# Altium schematic sheet 水温控制系统原理图.SchDoc
size A4
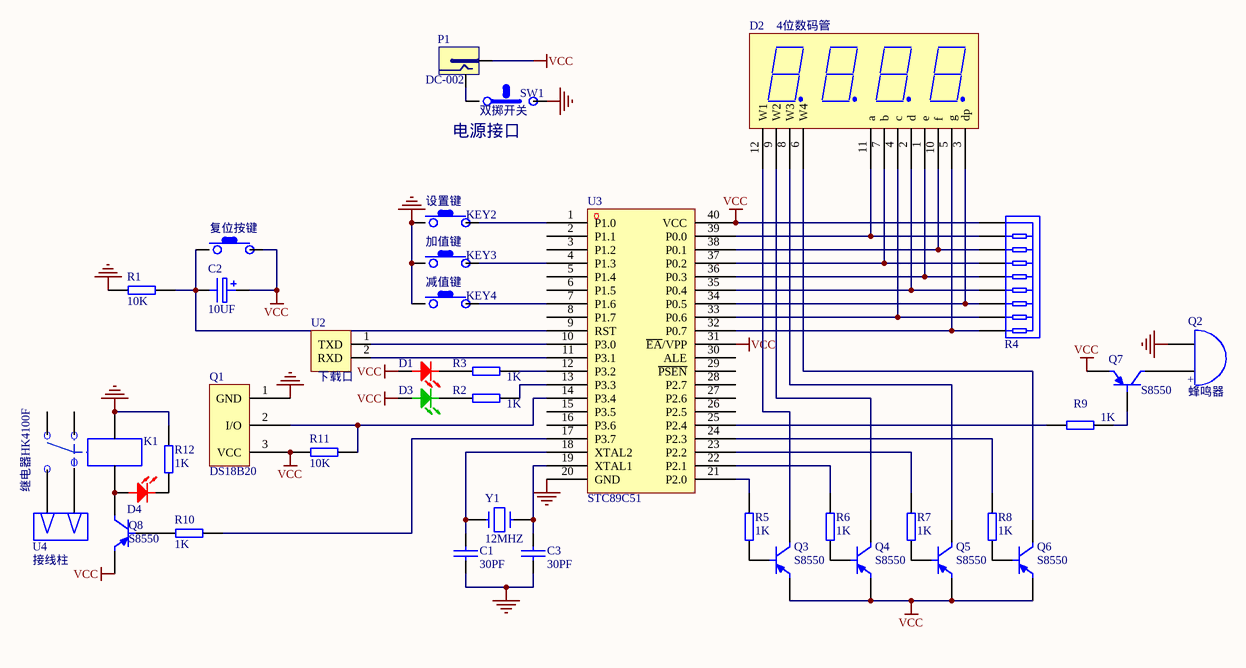
[diagram p0: 水温控制系统原理图.SchDoc]

## Parts
C1  30PF  [R38]
C2  10UF  [CD4]
C3  30PF  [R38]
D1  LED-RED  [LED-RED]  (value not drawn)
D2  4位数码管  [3641B]
D3  LED-GREEN  [LED-GREEN]  (value not drawn)
D4  LED-RED  [LED-RED]  (value not drawn)
K1  继电器HK4100F  [HK4100F]
KEY1  复位按键  [SW]
KEY2  设置键  [SW]
KEY3  加值键  [SW]
KEY4  减值键  [SW]
P1  DC-002  [DC-002]
Q1  DS18B20  [XH3P]
Q2  蜂鸣器  [蜂鸣器]
Q3  S8550  [三极管]
Q4  S8550  [三极管]
Q5  S8550  [三极管]
Q6  S8550  [三极管]
Q7  S8550  [三极管]
Q8  S8550  [三极管]
R1  10K  [AXIAL-0.3]
R2  1K  [AXIAL-0.3]
R3  1K  [AXIAL-0.3]
R4  10k  [R*9]  (value not drawn)
R5  1K  [AXIAL-0.3]
R6  1K  [AXIAL-0.3]
R7  1K  [AXIAL-0.3]
R8  1K  [AXIAL-0.3]
R9  1K  [AXIAL-0.3]
R10  1K  [AXIAL-0.3]
R11  10K  [AXIAL-0.3]
R12  1K  [AXIAL-0.3]
SW1  双掷开关  [SS12D07G5]
U2  下载口  [HDR2]
U3  STC89C51  [DIP40]
U4  接线柱  [KF301-2P]
Y1  12MHZ  [XTAL]

## Nets
GND: C1.2 C3.1 K1.5 KEY2.1 KEY3.1 KEY4.1 Q1.1(GND) Q2.2 R1.1 R12.1 SW1.2 U3.20(GND)
VCC: C2.1 D1.1 D3.1 KEY1.2 P1.1 Q1.3(VCC) Q3.1(E) Q4.1(E) Q5.1(E) Q6.1(E) Q7.1(E) Q8.1(E) R4.1 R11.2 U3.31(~{EA}/VPP) U3.40(VCC)
NetC1_1: C1.1 U3.18(XTAL2) Y1.2
NetC2_2: C2.2(E) KEY1.1 R1.2 U3.9(RST)
NetC3_2: C3.2 U3.19(XTAL1) Y1.1
NetD1_2: D1.2 R3.2
NetD2_1: D2.1(e) R4.5 U3.36(P0.3)
NetD2_2: D2.2(d) R4.6 U3.35(P0.4)
NetD2_3: D2.3(dp) R4.7 U3.34(P0.5)
NetD2_4: D2.4(c) R4.8 U3.33(P0.6)
NetD2_5: D2.5(g) R4.9 U3.32(P0.7)
NetD2_6: D2.6(W4) Q6.3(C)
NetD2_7: D2.7(b) R4.4 U3.37(P0.2)
NetD2_8: D2.8(W3) Q5.3(C)
NetD2_9: D2.9(W2) Q4.3(C)
NetD2_10: D2.10(f) R4.3 U3.38(P0.1)
NetD2_11: D2.11(a) R4.2 U3.39(P0.0)
NetD2_12: D2.12(W1) Q3.3(C)
NetD3_2: D3.2 R2.2
NetD4_1: D4.1 K1.2 Q8.3(C)
NetD4_2: D4.2 R12.2
NetK1_1: K1.1 U4.1
NetK1_4: K1.4 U4.2
NetKEY2_2: KEY2.2 U3.1(P1.0)
NetKEY3_2: KEY3.2 U3.4(P1.3)
NetKEY4_2: KEY4.2 U3.7(P1.6)
NetP1_2: P1.2 SW1.1
NetQ1_2: Q1.2(I/O) R11.1 U3.14(P3.4)
NetQ2_1: Q2.1 Q7.3(C)
NetQ3_2: Q3.2(B) R5.2
NetQ4_2: Q4.2(B) R6.2
NetQ5_2: Q5.2(B) R7.2
NetQ6_2: Q6.2(B) R8.2
NetQ7_2: Q7.2(B) R9.2
NetQ8_2: Q8.2(B) R10.1
NetR2_1: R2.1 U3.13(P3.3)
NetR3_1: R3.1 U3.12(P3.2)
NetR5_1: R5.1 U3.21(P2.0)
NetR6_1: R6.1 U3.22(P2.1)
NetR7_1: R7.1 U3.23(P2.2)
NetR8_1: R8.1 U3.24(P2.3)
NetR9_1: R9.1 U3.25(P2.4)
NetR10_2: R10.2 U3.17(P3.7)
NetU2_1: U2.1(TXD) U3.10(P3.0)
NetU2_2: U2.2(RXD) U3.11(P3.1)

Not connected (* = marked no-connect by the designer): K1 3 6; U3 2(P1.1) 3(P1.2) 5(P1.4) 6(P1.5) 8(P1.7) 15(P3.5) 16(P3.6) 26(P2.5) 27(P2.6) 28(P2.7) 29(~{PSEN}) 30(ALE)

## Notes on the sheet
- (near SW1) 电源接口
- (in symbol 蜂鸣器) +

## Library data of the parts
C1 C3 = 瓷片电容
C2 = 电解电容
KEY1-KEY4 = 微动开关
R1-R3 R5-R12 = RES
R4 = 排阻
U3 = STC89C52
Y1 = XTAL